# Altium schematic sheet sch_LEDCUBE.SchDoc
size A4; SheetNumber: 1; SheetTotal: 1
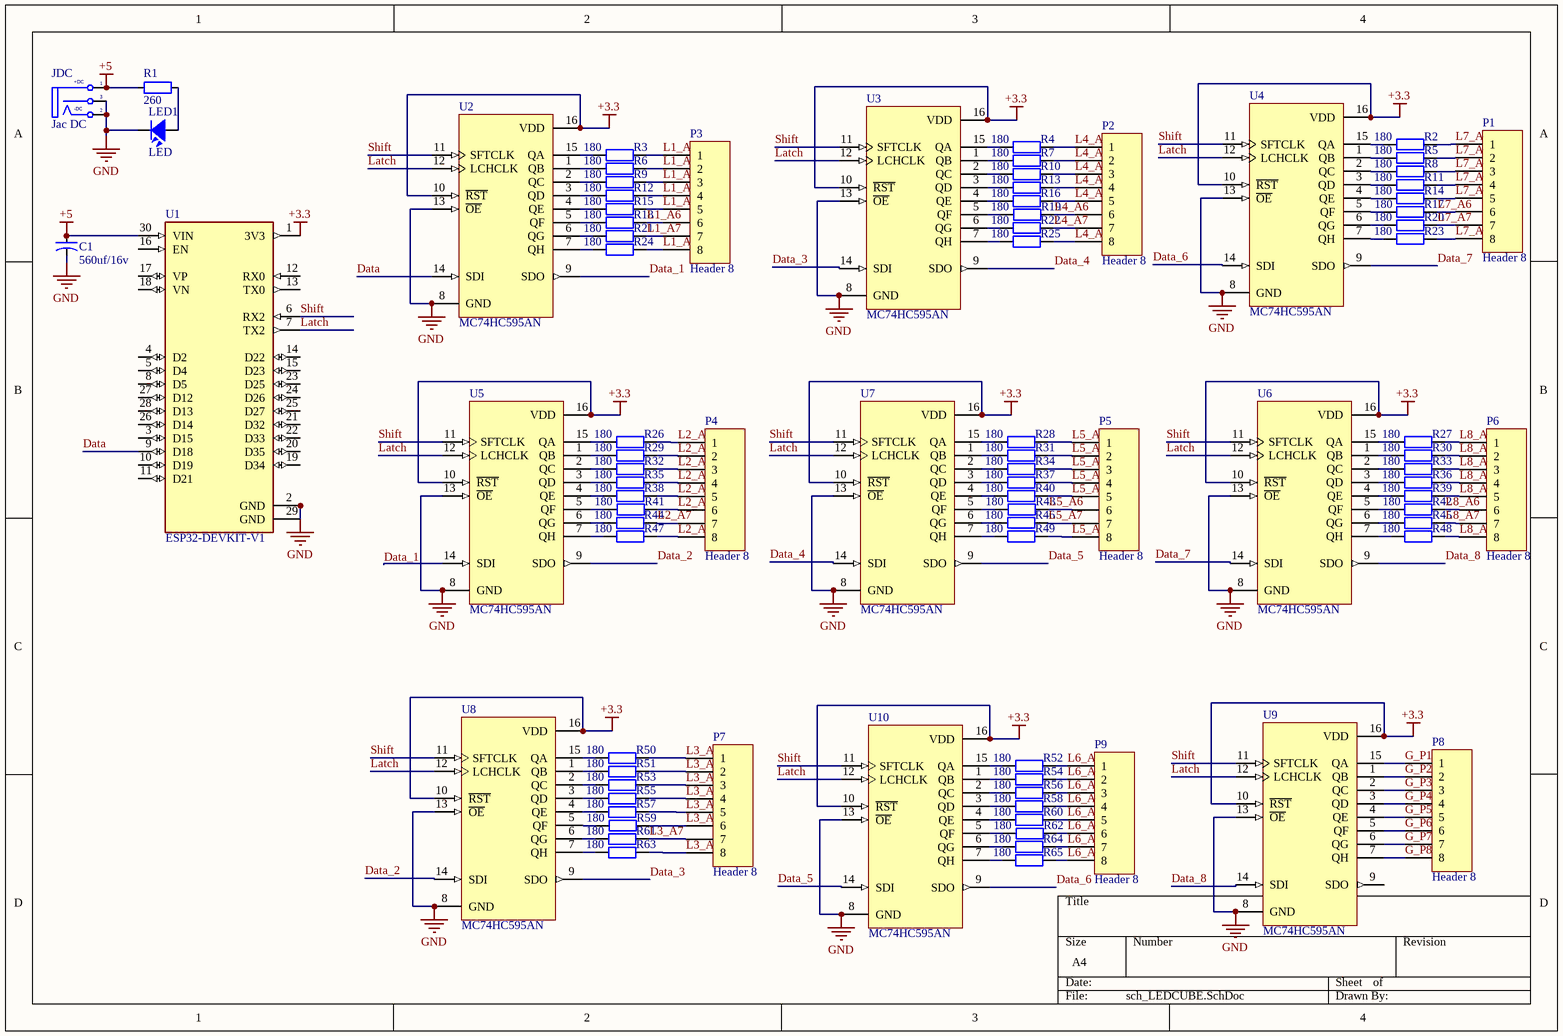
[diagram p0: sch_LEDCUBE.SchDoc]

## Parts
C1  560uf/16v  [CA-ALU-8]
JDC  Jac DC  [DC-IN]
LED1  LED  [LED-3]
P1  Header 8  [CON_8P]
P2  Header 8  [CON_8P]
P3  Header 8  [CON_8P]
P4  Header 8  [CON_8P]
P5  Header 8  [CON_8P]
P6  Header 8  [CON_8P]
P7  Header 8  [CON_8P]
P8  Header 8  [CON_8P]
P9  Header 8  [CON_8P]
R1  260  [RES-1/8W]
R2  180  [RES-SMD-1206]
R3  180  [RES-SMD-1206]
R4  180  [RES-SMD-1206]
R5  180  [RES-SMD-1206]
R6  180  [RES-SMD-1206]
R7  180  [RES-SMD-1206]
R8  180  [RES-SMD-1206]
R9  180  [RES-SMD-1206]
R10  180  [RES-SMD-1206]
R11  180  [RES-SMD-1206]
R12  180  [RES-SMD-1206]
R13  180  [RES-SMD-1206]
R14  180  [RES-SMD-1206]
R15  180  [RES-SMD-1206]
R16  180  [RES-SMD-1206]
R17  180  [RES-SMD-1206]
R18  180  [RES-SMD-1206]
R19  180  [RES-SMD-1206]
R20  180  [RES-SMD-1206]
R21  180  [RES-SMD-1206]
R22  180  [RES-SMD-1206]
R23  180  [RES-SMD-1206]
R24  180  [RES-SMD-1206]
R25  180  [RES-SMD-1206]
R26  180  [RES-SMD-1206]
R27  180  [RES-SMD-1206]
R28  180  [RES-SMD-1206]
R29  180  [RES-SMD-1206]
R30  180  [RES-SMD-1206]
R31  180  [RES-SMD-1206]
R32  180  [RES-SMD-1206]
R33  180  [RES-SMD-1206]
R34  180  [RES-SMD-1206]
R35  180  [RES-SMD-1206]
R36  180  [RES-SMD-1206]
R37  180  [RES-SMD-1206]
R38  180  [RES-SMD-1206]
R39  180  [RES-SMD-1206]
R40  180  [RES-SMD-1206]
R41  180  [RES-SMD-1206]
R42  180  [RES-SMD-1206]
R43  180  [RES-SMD-1206]
R44  180  [RES-SMD-1206]
R45  180  [RES-SMD-1206]
R46  180  [RES-SMD-1206]
R47  180  [RES-SMD-1206]
R48  180  [RES-SMD-1206]
R49  180  [RES-SMD-1206]
R50  180  [RES-SMD-1206]
R51  180  [RES-SMD-1206]
R52  180  [RES-SMD-1206]
R53  180  [RES-SMD-1206]
R54  180  [RES-SMD-1206]
R55  180  [RES-SMD-1206]
R56  180  [RES-SMD-1206]
R57  180  [RES-SMD-1206]
R58  180  [RES-SMD-1206]
R59  180  [RES-SMD-1206]
R60  180  [RES-SMD-1206]
R61  180  [RES-SMD-1206]
R62  180  [RES-SMD-1206]
R63  180  [RES-SMD-1206]
R64  180  [RES-SMD-1206]
R65  180  [RES-SMD-1206]
U1  ESP32-DEVKIT-V1  [MODULE_ESP32_DEVKIT_V1]
U2  MC74HC595AN  [DIP.100/16/W.300/L.900]
U3  MC74HC595AN  [DIP.100/16/W.300/L.900]
U4  MC74HC595AN  [DIP.100/16/W.300/L.900]
U5  MC74HC595AN  [DIP.100/16/W.300/L.900]
U6  MC74HC595AN  [DIP.100/16/W.300/L.900]
U7  MC74HC595AN  [DIP.100/16/W.300/L.900]
U8  MC74HC595AN  [DIP.100/16/W.300/L.900]
U9  MC74HC595AN  [DIP.100/16/W.300/L.900]
U10  MC74HC595AN  [DIP.100/16/W.300/L.900]

## Nets
+3.3: U1.1(3V3) U2.10(~{RST}) U2.16(VDD) U3.10(~{RST}) U3.16(VDD) U4.10(~{RST}) U4.16(VDD) U5.10(~{RST}) U5.16(VDD) U6.10(~{RST}) U6.16(VDD) U7.10(~{RST}) U7.16(VDD) U8.10(~{RST}) U8.16(VDD) U9.10(~{RST}) U9.16(VDD) U10.10(~{RST}) U10.16(VDD)
+5: C1.1 JDC.1(T) R1.2 U1.30(VIN)
GND: C1.2 JDC.2(TN) JDC.3(S) LED1.2 U1.2(GND) U1.29(GND) U2.8(GND) U2.13(~{OE}) U3.8(GND) U3.13(~{OE}) U4.8(GND) U4.13(~{OE}) U5.8(GND) U5.13(~{OE}) U6.8(GND) U6.13(~{OE}) U7.8(GND) U7.13(~{OE}) U8.8(GND) U8.13(~{OE}) U9.8(GND) U9.13(~{OE}) U10.8(GND) U10.13(~{OE})
Data: U1.9(D18) U2.14(SDI)
Data_1: U2.9(SDO) U5.14(SDI)
Data_2: U5.9(SDO) U8.14(SDI)
Data_3: U3.14(SDI) U8.9(SDO)
Data_4: U3.9(SDO) U7.14(SDI)
Data_5: U7.9(SDO) U10.14(SDI)
Data_6: U4.14(SDI) U10.9(SDO)
Data_7: U4.9(SDO) U6.14(SDI)
Data_8: U6.9(SDO) U9.14(SDI)
G_P1: P8.1 U9.15(QA)
G_P2: P8.2 U9.1(QB)
G_P3: P8.3 U9.2(QC)
G_P4: P8.4 U9.3(QD)
G_P5: P8.5 U9.4(QE)
G_P6: P8.6 U9.5(QF)
G_P7: P8.7 U9.6(QG)
G_P8: P8.8 U9.7(QH)
L1_A1: P3.1 R3.1
L1_A2: P3.2 R6.1
L1_A3: P3.3 R9.1
L1_A4: P3.4 R12.1
L1_A5: P3.5 R15.1
L1_A6: P3.6 R18.1
L1_A7: P3.7 R21.1
L1_A8: P3.8 R24.1
L2_A1: P4.1 R26.1
L2_A2: P4.2 R29.1
L2_A3: P4.3 R32.1
L2_A4: P4.4 R35.1
L2_A5: P4.5 R38.1
L2_A6: P4.6 R41.1
L2_A7: P4.7 R44.1
L2_A8: P4.8 R47.1
L3_A1: P7.1 R50.1
L3_A2: P7.2 R51.1
L3_A3: P7.3 R53.1
L3_A4: P7.4 R55.1
L3_A5: P7.5 R57.1
L3_A6: P7.6 R59.1
L3_A7: P7.7 R61.1
L3_A8: P7.8 R63.1
L4_A1: P2.1 R4.1
L4_A2: P2.2 R7.1
L4_A3: P2.3 R10.1
L4_A4: P2.4 R13.1
L4_A5: P2.5 R16.1
L4_A6: P2.6 R19.1
L4_A7: P2.7 R22.1
L4_A8: P2.8 R25.1
L5_A1: P5.1 R28.1
L5_A2: P5.2 R31.1
L5_A3: P5.3 R34.1
L5_A4: P5.4 R37.1
L5_A5: P5.5 R40.1
L5_A6: P5.6 R43.1
L5_A7: P5.7 R46.1
L5_A8: P5.8 R49.1
L6_A1: P9.1 R52.1
L6_A2: P9.2 R54.1
L6_A3: P9.3 R56.1
L6_A4: P9.4 R58.1
L6_A5: P9.5 R60.1
L6_A6: P9.6 R62.1
L6_A7: P9.7 R64.1
L6_A8: P9.8 R65.1
L7_A1: P1.1 R2.1
L7_A2: P1.2 R5.1
L7_A3: P1.3 R8.1
L7_A4: P1.4 R11.1
L7_A5: P1.5 R14.1
L7_A6: P1.6 R17.1
L7_A7: P1.7 R20.1
L7_A8: P1.8 R23.1
L8_A1: P6.1 R27.1
L8_A2: P6.2 R30.1
L8_A3: P6.3 R33.1
L8_A4: P6.4 R36.1
L8_A5: P6.5 R39.1
L8_A6: P6.6 R42.1
L8_A7: P6.7 R45.1
L8_A8: P6.8 R48.1
Latch: U1.7(TX2) U2.12(LCHCLK) U3.12(LCHCLK) U4.12(LCHCLK) U5.12(LCHCLK) U6.12(LCHCLK) U7.12(LCHCLK) U8.12(LCHCLK) U9.12(LCHCLK) U10.12(LCHCLK)
Shift: U1.6(RX2) U2.11(SFTCLK) U3.11(SFTCLK) U4.11(SFTCLK) U5.11(SFTCLK) U6.11(SFTCLK) U7.11(SFTCLK) U8.11(SFTCLK) U9.11(SFTCLK) U10.11(SFTCLK)
NetLED1_1: LED1.1 R1.1
NetR2_2: R2.2 U4.15(QA)
NetR3_2: R3.2 U2.15(QA)
NetR4_2: R4.2 U3.15(QA)
NetR5_2: R5.2 U4.1(QB)
NetR6_2: R6.2 U2.1(QB)
NetR7_2: R7.2 U3.1(QB)
NetR8_2: R8.2 U4.2(QC)
NetR9_2: R9.2 U2.2(QC)
NetR10_2: R10.2 U3.2(QC)
NetR11_2: R11.2 U4.3(QD)
NetR12_2: R12.2 U2.3(QD)
NetR13_2: R13.2 U3.3(QD)
NetR14_2: R14.2 U4.4(QE)
NetR15_2: R15.2 U2.4(QE)
NetR16_2: R16.2 U3.4(QE)
NetR17_2: R17.2 U4.5(QF)
NetR18_2: R18.2 U2.5(QF)
NetR19_2: R19.2 U3.5(QF)
NetR20_2: R20.2 U4.6(QG)
NetR21_2: R21.2 U2.6(QG)
NetR22_2: R22.2 U3.6(QG)
NetR23_2: R23.2 U4.7(QH)
NetR24_2: R24.2 U2.7(QH)
NetR25_2: R25.2 U3.7(QH)
NetR26_2: R26.2 U5.15(QA)
NetR27_2: R27.2 U6.15(QA)
NetR28_2: R28.2 U7.15(QA)
NetR29_2: R29.2 U5.1(QB)
NetR30_2: R30.2 U6.1(QB)
NetR31_2: R31.2 U7.1(QB)
NetR32_2: R32.2 U5.2(QC)
NetR33_2: R33.2 U6.2(QC)
NetR34_2: R34.2 U7.2(QC)
NetR35_2: R35.2 U5.3(QD)
NetR36_2: R36.2 U6.3(QD)
NetR37_2: R37.2 U7.3(QD)
NetR38_2: R38.2 U5.4(QE)
NetR39_2: R39.2 U6.4(QE)
NetR40_2: R40.2 U7.4(QE)
NetR41_2: R41.2 U5.5(QF)
NetR42_2: R42.2 U6.5(QF)
NetR43_2: R43.2 U7.5(QF)
NetR44_2: R44.2 U5.6(QG)
NetR45_2: R45.2 U6.6(QG)
NetR46_2: R46.2 U7.6(QG)
NetR47_2: R47.2 U5.7(QH)
NetR48_2: R48.2 U6.7(QH)
NetR49_2: R49.2 U7.7(QH)
NetR50_2: R50.2 U8.15(QA)
NetR51_2: R51.2 U8.1(QB)
NetR52_2: R52.2 U10.15(QA)
NetR53_2: R53.2 U8.2(QC)
NetR54_2: R54.2 U10.1(QB)
NetR55_2: R55.2 U8.3(QD)
NetR56_2: R56.2 U10.2(QC)
NetR57_2: R57.2 U8.4(QE)
NetR58_2: R58.2 U10.3(QD)
NetR59_2: R59.2 U8.5(QF)
NetR60_2: R60.2 U10.4(QE)
NetR61_2: R61.2 U8.6(QG)
NetR62_2: R62.2 U10.5(QF)
NetR63_2: R63.2 U8.7(QH)
NetR64_2: R64.2 U10.6(QG)
NetR65_2: R65.2 U10.7(QH)

Not connected (* = marked no-connect by the designer): U1 3(D15) 4(D2) 5(D4) 8(D5) 10(D19) 11(D21) 12(RX0) 13(TX0) 14(D22) 15(D23) 16(EN) 17(VP) 18(VN) 19(D34) 20(D35) 21(D32) 22(D33) 23(D25) 24(D26) 25(D27) 26(D14) 27(D12) 28(D13); U9 9(SDO)

## Notes on the sheet
- (in symbol DCIN) +DC; -DC

## Library data of the parts
C1 = CAP-ALU-DIP: Capacitor (Semiconductor SIM Model); Value: 104; LatestRevisionDate: 17-Jul-2002; LatestRevisionNote: Re-released for DXP Platform.; PackageReference: C1206; Publisher: Altium Limited
JDC = DCIN: Jac DC input; Value: Jac DC
LED1 = LED: LED Single colour Green and Red; Value: LED 3 ly Single Colour
P1-P9 = Header 8: Header, 8-Pin; LatestRevisionDate: 17-Jul-2002; LatestRevisionNote: Re-released for DXP Platform.; Publisher: Altium Limited
R1 = Resistor - DIP: Value: R1/4W - 1K
R2-R65 = Resistor - SMD: Resistor SMD; Manufacturer: Generic Components; Class: Passive; Published: 08/06/2000; Publisher: Altium Hobart Technology Centre
U1 = ESP32-DEVKIT-V1: Dual core, Wi-Fi: 2.4 GHz up to 150 Mbits/s,BLE (Bluetooth Low Energy) and legacy Bluetooth, 32 bits, Up to 240 MHz; Value: *; MP: ESP32-DEVKIT-V1; Availability: Unavailable; Package: None; Price: None
U2-U10 = MC74HC595AN: 8-Bit Serial-Input/Serial or Prallel-Output Shift Register with Latched 3-State Outputs; Published: 15-Apr-2002; DatasheetVersion: Mar-2000; PackageVersion: Apr-2000; PackageReference: 648-08; Publisher: Altium Limited; PackageDescription: DIP; 16 Leads; Row Spacing 7.62 mm; Pitch 2.54 mm; Code_JEDEC: MS-001-BB; ComponentLink1Description: Manufacturer Link; ComponentLink1URL: http://www.onsemi.com/; ComponentLink2Description: Datasheet; ComponentLink2URL: http://www.onsemi.com/pub/Collateral/MC74HC595A-D.PDF